# Altium schematic sheet Sheet1.SchDoc
size A3; CheckedBy: PHAN TRONG TIEN; CompanyName: HANOI UNIVERSITY OF INDUSTRY; DrawnBy: PHAN TRONG TIEN; Engineer: P.TRONG TIEN; Rule: PcbType=ProtelPcb
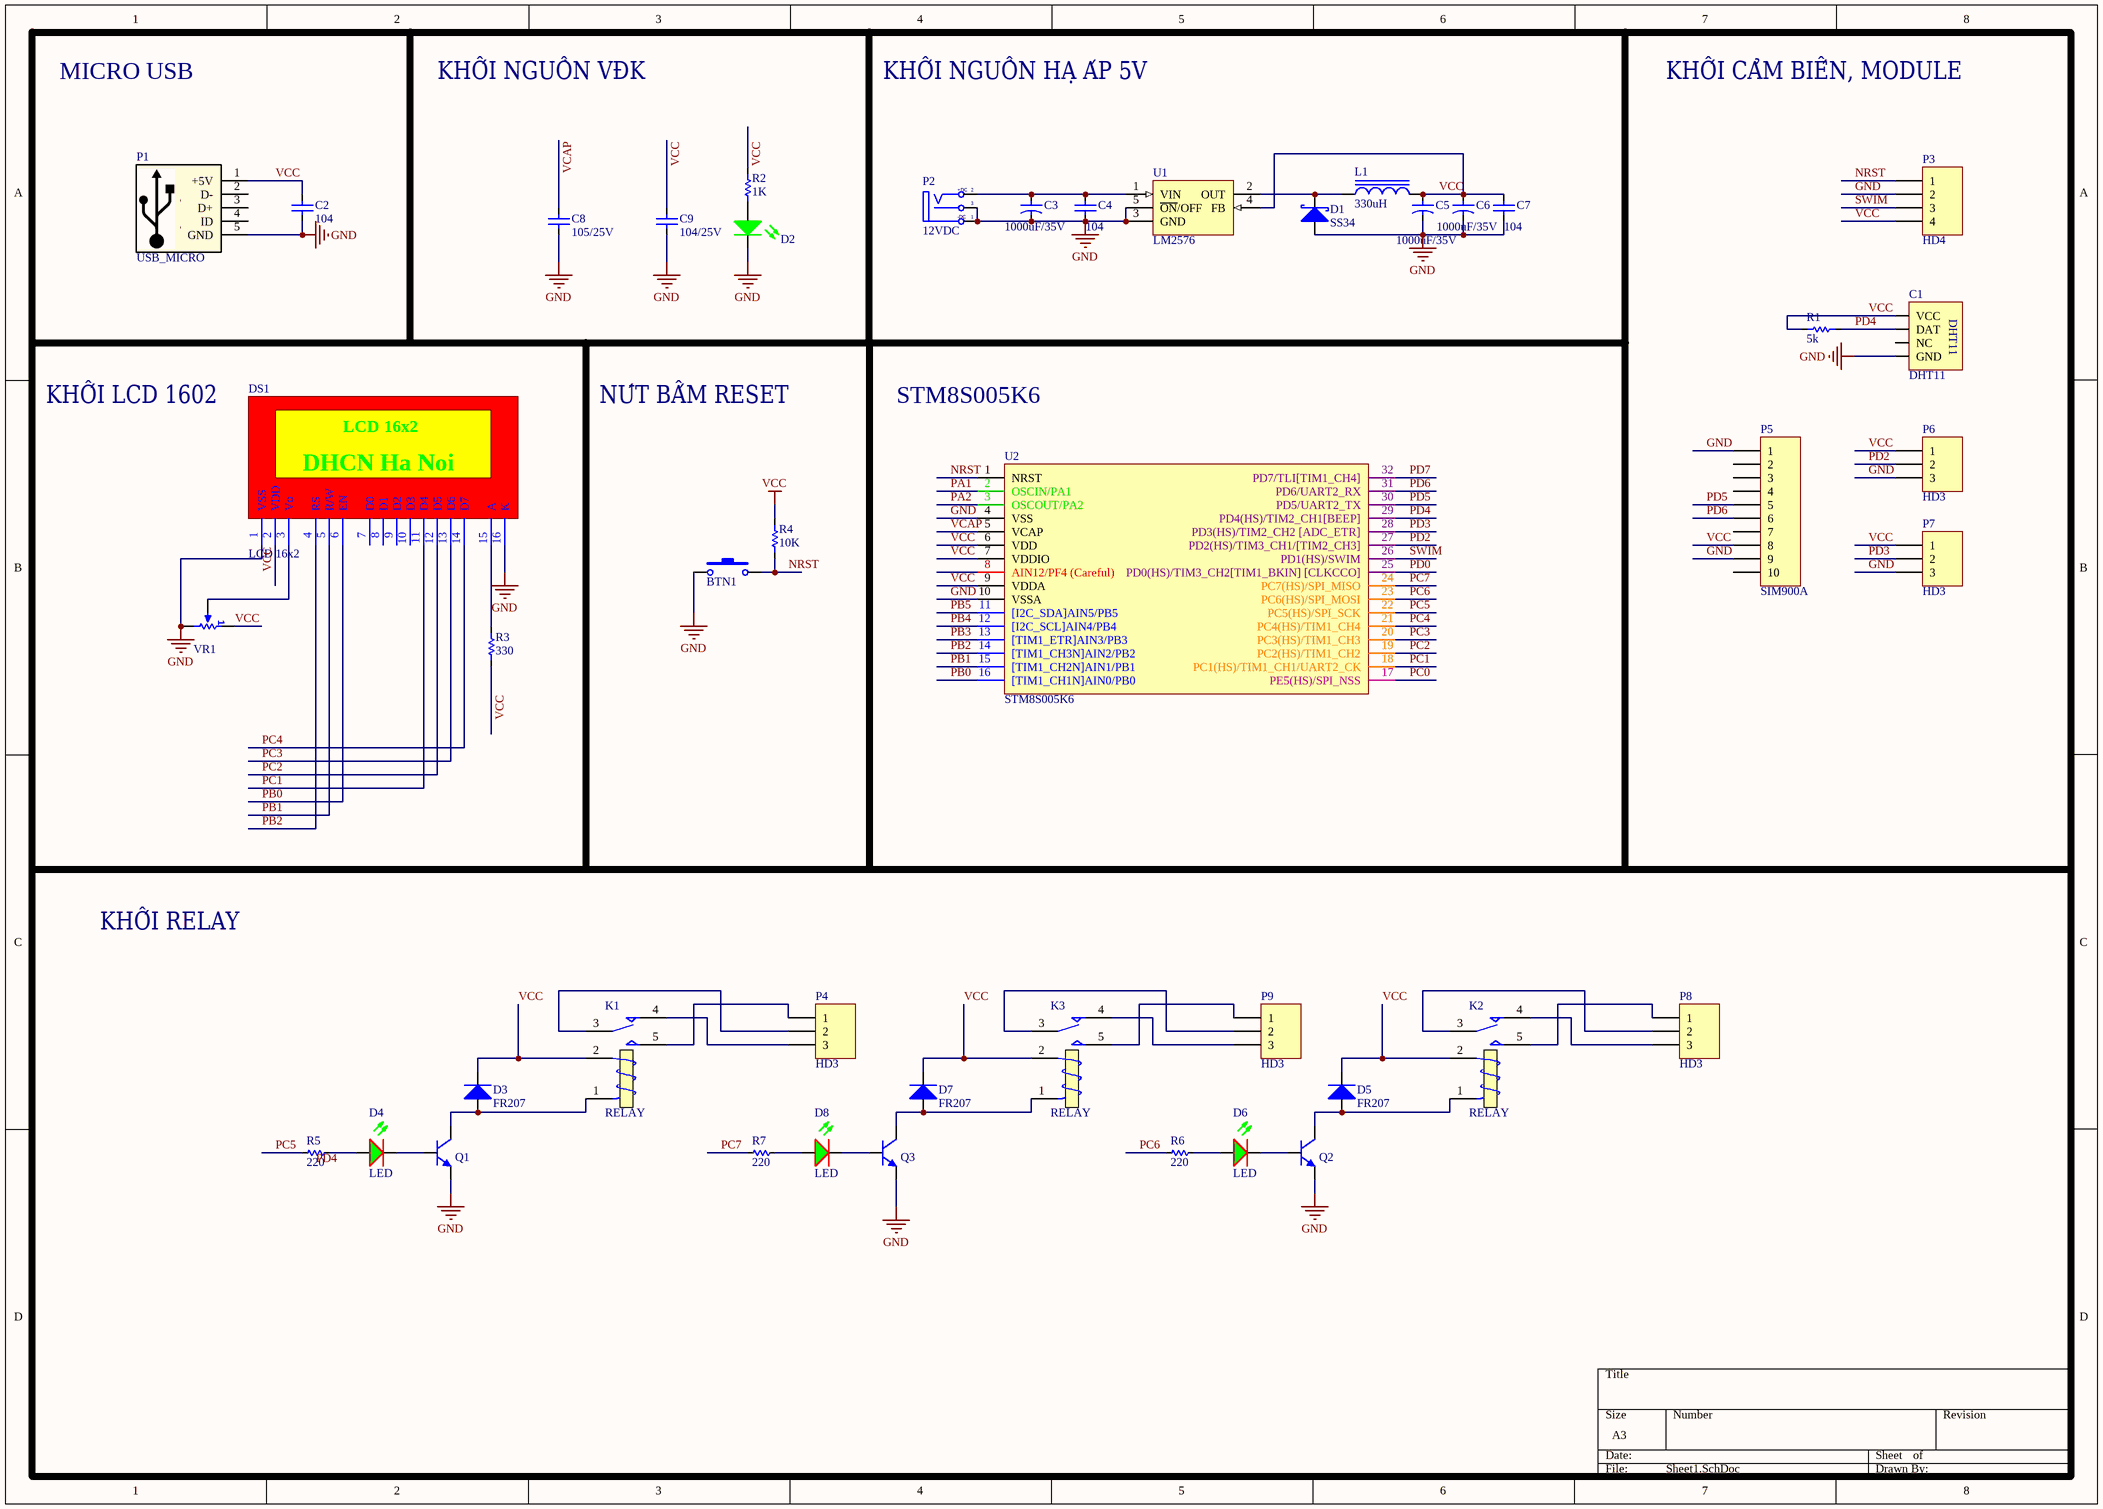
[diagram p0: Sheet1.SchDoc]

## Parts
BTN1  BT  [BUTTON SMD MINI]  (value not drawn)
C1  DHT11  [DHT11]
C2  104  [CAP-0805]
C3  1000uF/35V  [CAP 13x25x5]
C4  104  [CAP-0603]
C5  1000uF/35V  [CAP 13x25x5]
C6  1000uF/35V  [CAP 13x25x5]
C7  104  [CAP-0603]
C8  105/25V  [CAP-0805]
C9  104/25V  [CAP-0805]
D1  SS34  [DO-214AC]
D2  LED-G  [LED-0603-G]  (value not drawn)
D3  FR207  [DO-41-300MIL-1N4007]
D4  LED  [LED_5mm]
D5  FR207  [DO-41-300MIL-1N4007]
D6  LED  [LED_5mm]
D7  FR207  [DO-41-300MIL-1N4007]
D8  LED  [LED_5mm]
DS1  LCD 16x2  [LCD16x2_V1]
K1  RELAY  [RELAY 12V_112D1]
K2  RELAY  [RELAY 12V_112D1]
K3  RELAY  [RELAY 12V_112D1]
L1  330uH  [INDUCTOR 2]
P1  USB_MICRO  [USB_MICRO]
P2  value 12VDC  [JACK DC 5.5x2]  (hidden comment: JACK DC)
P3  HD4  [XH2.54-4A]
P4  HD3  [CON 3]
P5  SIM900A  [HD 10]
P6  HD3  [JUMP 3]
P7  HD3  [JUMP 3]
P8  HD3  [CON 3]
P9  HD3  [CON 3]
Q1  C1815  [TO 92]  (value not drawn)
Q2  C1815  [TO 92]  (value not drawn)
Q3  C1815  [TO 92]  (value not drawn)
R1  5k  [R-0805]
R2  1K  [R-0805-1K]
R3  330  [R-0805-1K]
R4  10K  [R-0805-1K]
R5  220  [RES-1/4W]
R6  220  [RES-1/4W]
R7  220  [RES-1/4W]
U1  LM2576  [TO 263 [LM2576]]
U2  STM8S005K6  [LQFP-32-STM8S005K6]
VR1  VR  [POT-3296W]  (value not drawn)

## Nets
GND: BTN1.1 C1.4(GND) C2.2 C3.2 C4.2 C5.2 C6.2 C7.2 C8.2 C9.2 D1.1(A) D2.2(K) DS1.1(VSS) DS1.16(K) P1.5(GND) P2.1(T) P2.3(S) P3.2 P5.1 P5.9 P6.3 P7.3 Q1.1(E) Q2.1(E) Q3.1(E) U1.3(GND) U1.5(~{ON}/OFF) U2.4(VSS) U2.10(VSSA) VR1.3(BOT)
VCC: C1.1(VCC) C2.1 C5.1 C6.1 C7.1 C9.1 D3.2(K) D5.2(K) D7.2(K) DS1.2(VDD) K1.2(T1) K2.2(T1) K3.2(T1) L1.2 P1.1(+5V) P3.4 P5.8 P6.1 P7.1 R1.1 R2.2 R3.1 R4.2 U1.4(FB) U2.6(VDD) U2.7(VDDIO) U2.9(VDDA) VR1.1(TOP)
NRST: BTN1.2 P3.1 R4.1 U2.1(NRST)
PA1: U2.2(OSCIN/PA1)
PA2: U2.3(OSCOUT/PA2)
PB0: DS1.6(EN) U2.16([TIM1_CH1N]AIN0/PB0)
PB1: DS1.5(R/W) U2.15([TIM1_CH2N]AIN1/PB1)
PB2: DS1.4(RS) U2.14([TIM1_CH3N]AIN2/PB2)
PB3: U2.13([TIM1_ETR]AIN3/PB3)
PB4: U2.12([I2C_SCL]AIN4/PB4)
PB5: U2.11([I2C_SDA]AIN5/PB5)
PC0: U2.17(PE5(HS)/SPI_NSS)
PC1: DS1.11(D4) U2.18(PC1(HS)/TIM1_CH1/UART2_CK)
PC2: DS1.12(D5) U2.19(PC2(HS)/TIM1_CH2)
PC3: DS1.13(D6) U2.20(PC3(HS)/TIM1_CH3)
PC4: DS1.14(D7) U2.21(PC4(HS)/TIM1_CH4)
PC5: R5.1 U2.22(PC5(HS)/SPI_SCK)
PC6: R6.1 U2.23(PC6(HS)/SPI_MOSI)
PC7: R7.1 U2.24(PC7(HS)/SPI_MISO)
PD0: U2.25(PD0(HS)/TIM3_CH2[TIM1_BKIN]_[CLKCCO])
PD2: P6.2 U2.27(PD2(HS)/TIM3_CH1/[TIM2_CH3])
PD3: P7.2 U2.28(PD3(HS)/TIM2_CH2_[ADC_ETR])
PD4: C1.2(DAT) R1.2 U2.29(PD4(HS)/TIM2_CH1[BEEP])
PD5: P5.5 U2.30(PD5/UART2_TX)
PD6: P5.6 U2.31(PD6/UART2_RX)
PD7: U2.32(PD7/TLI[TIM1_CH4])
SWIM: P3.3 U2.26(PD1(HS)/SWIM)
VCAP: C8.1 U2.5(VCAP)
NetC3_1: C3.1 C4.1 P2.2(TN) U1.1(VIN)
NetD1_2: D1.2(K) L1.1 U1.2(OUT)
NetD2_1: D2.1(A) R2.1
NetD3_1: D3.1(A) K1.1(T2) Q1.2(C)
NetD4_1: D4.1(A) R5.2
NetD4_2: D4.2(K) Q1.3(B)
NetD5_1: D5.1(A) K2.1(T2) Q2.2(C)
NetD6_1: D6.1(A) R6.2
NetD6_2: D6.2(K) Q2.3(B)
NetD7_1: D7.1(A) K3.1(T2) Q3.2(C)
NetD8_1: D8.1(A) R7.2
NetD8_2: D8.2(K) Q3.3(B)
NetDS1_3: DS1.3(Vo) VR1.2(TAP)
NetDS1_15: DS1.15(A) R3.2
NetK1_3: K1.3(COM) P4.2
NetK1_4: K1.4(NC) P4.3
NetK1_5: K1.5(NO) P4.1
NetK2_3: K2.3(COM) P8.2
NetK2_4: K2.4(NC) P8.3
NetK2_5: K2.5(NO) P8.1
NetK3_3: K3.3(COM) P9.2
NetK3_4: K3.4(NC) P9.3
NetK3_5: K3.5(NO) P9.1

Not connected (* = marked no-connect by the designer): C1 3(NC); DS1 7(D0) 8(D1) 9(D2) 10(D3); P1 2(D-) 3(D+) 4(ID); P5 2 3 4 7 10; U2 8(AIN12/PF4_(Careful))

## Notes on the sheet
- MICRO USB
- KHỐI NGUỒN VĐK
- KHỐI NGUỒN HẠ ÁP 5V
- KHỐI CẢM BIẾN, MODULE
- KHỐI LCD 1602
- NÚT BẤM RESET
- STM8S005K6
- KHỐI RELAY
- Labels drawn without touching a wire or pin: PD4
- (in symbol JACK DC) +DC; -DC
- (in symbol LCD TypeA) DHCN Ha Noi

## Library data of the parts
BTN1 = BUTTON
C1 = DHT11: Manufacturer: W¨¹rth Elektronik eiSos GmbH; partNo: 613004143121; ComponentLink1 Description: Manufacturer; ComponentLink2 Description: Datasheet; NoPins: 04; Created Date: 29 March 2013; ComponentLink1URL: http://www.we-online.com; ComponentLink2URL: http://katalog.we-online.de/em/datasheet/6130xx143121.pdf; Created by: Karrer Zheng
C2 = CAP-CER-22pF-50V-0805-10%: 22pF ±5% 50V Ceramic Capacitor C0G, NP0 0805 (2012 Metric); Manufacturer: Samsung Electro-Mechanics America, Inc.; Manufacturer Part Number: CL21B105KOFNNNE; Capacitance: 1µF; Tolerance: ±10%; Voltage - Rated: 16V; Temperature Coefficient: X7R; RoHS: RoHS Compliant; Category: Capacitors; Packaging: Cut Tape (CT); Part Status: Active; Operating Temperature: -55°C ~ 125°C; Features: -; Ratings: -; Applications: General Purpose; Failure Rate: *; Mounting Type: Surface Mount, MLCC; Package / Case: 0805 (2012 Metric); Size / Dimension: 0.079" L x 0.049" W (2.00mm x 1.25mm); Height - Seated (Max): -; Thickness (Max): 0.053" (1.35mm); Lead Spacing: -; Lead Style: -; ComponentLink1URL: http://www.samsungsem.com/kr/front/downloadcms.do?path=/kr/support/product-search/mlcc/__icsFiles/afieldfile/2014/11/05&fileName=C_CL21B105KOFNNNE.pdf; ComponentLink1Description: http://www.samsungsem.com/kr/front/downloadcms.do?path=/kr/support/product-search/mlcc/__icsFiles/afieldfile/2014/11/05&fileName=C_CL21B105KOFNNNE.pdf; Supplier 1: Digi-Key; Stock 1: 35138; Pricing 1: 1=0.1, 10=0.044, 25=0.032, 50=0.024, 100=0.0196, 250=0.0164, 500=0.014, 1000=0.011 (USD); ComponentLink2URL: http://www.samsungsem.com/kr/front/downloadcms.do?path=/kr/support/product-search/mlcc/__icsFiles/afieldfile/2014/11/05&fileName=C_CL21C220JBANNNC.pdf; ComponentLink2Description: http://www.samsungsem.com/kr/front/downloadcms.do?path=/kr/support/product-search/mlcc/__icsFiles/afieldfile/2014/11/05&fileName=C_CL21C220JBANNNC.pdf; Supplier Part Number 1: 1276-1047-1-ND
C3 C5 C6 = CAP 1000uF/35V
C4 C7 = CAP-CER-102-50V-0603-10%_6: 1000pF 50V Ceramic Capacitor X7R 0603 (1608 Metric) 0.063" L x 0.031" W (1.60mm x 0.80mm); Manufacturer: Samsung Electro-Mechanics America, Inc.; Manufacturer Part Number: CL10B102KB8NNNC; Tolerance: ±10%; Supplier 1: Digi-Key; RoHS: RoHS Compliant; Category: Capacitors; Stock 1: 208000; Pricing 1: 4000=0.00322, 8000=0.00294, 12000=0.0028, 28000=0.00266, 100000=0.00193 (USD); Packaging: Tape & Reel (TR); Part Status: Active; Capacitance: 1000pF; Voltage - Rated: 50V; Temperature Coefficient: X7R; Operating Temperature: -55°C ~ 125°C; Features: -; Ratings: -; Applications: General Purpose; Failure Rate: *; Mounting Type: Surface Mount, MLCC; Package / Case: 0603 (1608 Metric); Size / Dimension: 0.063" L x 0.031" W (1.60mm x 0.80mm); Height - Seated (Max): -; Thickness (Max): 0.035" (0.90mm); Lead Spacing: -; Lead Style: -; ComponentLink1URL: http://www.samsungsem.com/kr/support/product-search/mlcc/__icsFiles/afieldfile/2016/08/18/S_CL10B102KB8NNNC.pdf; ComponentLink1Description: http://www.samsungsem.com/kr/support/product-search/mlcc/__icsFiles/afieldfile/2016/08/18/S_CL10B102KB8NNNC.pdf; Supplier Part Number 1: 1276-1018-2-ND
C8 C9 = CAP-CER-104-25V-0805-10%: 0.10µF ±10% 25V Ceramic Capacitor X7R 0805 (2012 Metric); Manufacturer: Samsung Electro-Mechanics America, Inc.; Manufacturer Part Number: CL21B104KACNNNC; Supplier 1: Digi-Key; RoHS: RoHS Compliant; Category: Capacitors; Stock 1: 288005; Pricing 1: 1=0.1, 10=0.033, 25=0.024, 50=0.018, 100=0.0147, 250=0.01232, 500=0.0105, 1000=0.00825 (USD); Packaging: Cut Tape (CT); Part Status: Active; Capacitance: 0.10µF; Tolerance: ±10%; Voltage - Rated: 25V; Temperature Coefficient: X7R; Operating Temperature: -55°C ~ 125°C; Features: -; Ratings: -; Applications: General Purpose; Failure Rate: *; Mounting Type: Surface Mount, MLCC; Package / Case: 0805 (2012 Metric); Size / Dimension: 0.079" L x 0.049" W (2.00mm x 1.25mm); Height - Seated (Max): -; Thickness (Max): 0.037" (0.95mm); Lead Spacing: -; Lead Style: -; ComponentLink1URL: http://www.samsungsem.com/kr/support/product-search/mlcc/__icsFiles/afieldfile/2016/08/18/S_CL21B104KACNNNC.pdf; ComponentLink1Description: http://www.samsungsem.com/kr/support/product-search/mlcc/__icsFiles/afieldfile/2016/08/18/S_CL21B104KACNNNC.pdf; Supplier Part Number 1: 1276-1099-1-ND
D1 = SS14: Diode Schottky 40V 1A Surface Mount SMA (DO-214AC); Manufacturer: Fairchild Semiconductor; Voltage - Forward (Vf) (Max) @ If: 500mV @ 1A; Speed: Fast Recovery =< 500ns, > 200mA (Io); Current - Reverse Leakage @ Vr: 200µA @ 40V; Supplier 1: Digi-Key; Manufacturer Part Number: SS14; RoHS: RoHS Compliant; Category: Discrete Semiconductor Products; Stock 1: 120000; Pricing 1: 7500=0.08041, 15000=0.07332, 37500=0.06859, 52500=0.06149, 187500=0.05913 (USD); Packaging: Tape & Reel (TR); Part Status: Active; Diode Type: Schottky; Voltage - DC Reverse (Vr) (Max): 40V; Current - Average Rectified (Io): 1A; Reverse Recovery Time (trr): -; Capacitance @ Vr, F: -; Mounting Type: Surface Mount; Package / Case: DO-214AC, SMA; Supplier Device Package: SMA (DO-214AC); Operating Temperature - Junction: -65°C ~ 125°C; ComponentLink1URL: https://www.fairchildsemi.com/datasheets/SS/SS12.pdf; ComponentLink1Description: https://www.fairchildsemi.com/datasheets/SS/SS12.pdf; Supplier Part Number 1: SS14TR-ND; Supplier 2: Digi-Key; Stock 2: 297273; Pricing 2: 1=0.44, 10=0.33, 100=0.1867, 500=0.12364, 1000=0.09478 (USD); ComponentLink2URL: http://www.diodes.com/_files/datasheets/ds30217.pdf; ComponentLink2Description: http://www.diodes.com/_files/datasheets/ds30217.pdf; Supplier Part Number 2: 1N5819HW-FDICT-ND
D2 = LED-0603-G: Green 570nm LED Indication - Discrete 2.1V 0603 (1608 Metric); Manufacturer: Everlight Electronics Co Ltd; Manufacturer Part Number: QTLP601C4TR; Lens Color: Colorless; Lens Transparency: Clear; Millicandela Rating: 15mcd; Lens Style/Size: Rectangle with Flat Top, 1.20mm x 0.80mm; Current - Test: 20mA; Viewing Angle: 120°; Wavelength - Peak: 565nm; Supplier 1: Digi-Key; RoHS: RoHS Compliant; Category: Optoelectronics; Stock 1: 3227; Pricing 1: 1=0.51, 10=0.366, 25=0.2808, 100=0.1832, 250=0.13432, 500=0.11396, 1000=0.09361 (USD); Packaging: Cut Tape (CT); Part Status: Active; Color: Green; Voltage - Forward (Vf) (Typ): 2.1V; Mounting Type: Surface Mount; Wavelength - Dominant: 570nm; Features: -; Package / Case: 0603 (1608 Metric); Supplier Device Package: *; Size / Dimension: 1.60mm L x 0.80mm W; Height (Max): 0.60mm; ComponentLink1URL: http://media.digikey.com/pdf/Data%20Sheets/Everlight%20PDFs/QTLP601C-2,3,4,7,B.pdf; ComponentLink1Description: http://media.digikey.com/pdf/Data%20Sheets/Everlight%20PDFs/QTLP601C-2,3,4,7,B.pdf; Supplier Part Number 1: 1080-1405-1-ND
D3 D5 D7 = 1N4007: Diode Standard 1000V (1kV) 1A Surface Mount SMB; Manufacturer: Diodes Incorporated; Manufacturer Part Number: RS1MB-13; Voltage - Forward (Vf) (Max) @ If: 1.3V @ 1A; Speed: Fast Recovery =< 500ns, > 200mA (Io); Reverse Recovery Time (trr): 500ns; Current - Reverse Leakage @ Vr: 5µA @ 1000V; Capacitance @ Vr, F: 15pF @ 4V, 1MHz; Supplier 1: Digi-Key; RoHS: RoHS non-compliant; Category: Discrete Semiconductor Products; Stock 1: 0; Pricing 1: 30000=0 (USD); Packaging: Tape & Reel (TR); Part Status: Discontinued; Diode Type: Standard; Voltage - DC Reverse (Vr) (Max): 1000V (1kV); Current - Average Rectified (Io): 1A; Mounting Type: Surface Mount; Package / Case: DO-214AA, SMB; Supplier Device Package: SMB; Operating Temperature - Junction: -65°C ~ 150°C; ComponentLink1URL: http://media.digikey.com/pdf/Data%20Sheets/Diodes%20PDFs/RS1.pdf; ComponentLink1Description: http://media.digikey.com/pdf/Data%20Sheets/Diodes%20PDFs/RS1.pdf; Supplier Part Number 1: RS1MBDITR-ND
DS1 = LCD TypeA
K1-K3 = RELAY D
L1 = INDUCTOR
P2 = JACK DC: Jac DC input
P3 = HEADER 4
P4 P6-P9 = HEADER 3
P5 = HEADER 10
Q1-Q3 = C1815-TO92
R1 = R-0805: No Solder Or Re-Calculated
R2-R4 = R-0805/5%-1K: RES SMD 1K OHM 5% 1/8W 0805; Manufacturer: Yageo; Manufacturer Part Number: RC0805JR-071KL; Power (Watts): 0.125W, 1/8W; Temperature Coefficient: ±100ppm/°C; Supplier 1: Digi-Key; RoHS: RoHS Compliant; Category: Resistors; Stock 1: 1774840; Pricing 1: 1=0.1, 10=0.018, 25=0.0128, 100=0.0073, 250=0.00556, 500=0.00444, 1000=0.00326, 2500=0.00283 (USD); Packaging: Cut Tape (CT); Part Status: Active; Resistance (Ohms): 1k; Tolerance: ±5%; Composition: Thick Film; Features: Moisture Resistant; Operating Temperature: -55°C ~ 155°C; Package / Case: 0805 (2012 Metric); Supplier Device Package: 0805; Size / Dimension: 0.079" L x 0.049" W (2.00mm x 1.25mm); Height: 0.024" (0.60mm); Number of Terminations: 2; Failure Rate: -; ComponentLink1URL: http://www.yageo.com/documents/recent/PYu-RC_Group_51_RoHS_L_04.pdf; ComponentLink1Description: http://www.yageo.com/documents/recent/PYu-RC_Group_51_RoHS_L_04.pdf; Supplier Part Number 1: 311-1.0KARCT-ND
R5-R7 = Res: Manufacturer: Generic Components; Class: Passive; SubClass: R; Published: 08/06/2000; Publisher: Altium Hobart Technology Centre
U2 = STM8S005K6: STM8 STM8S Microcontroller IC 8-Bit 16MHz 32KB (32K x 8) FLASH 32-LQFP (7x7); Manufacturer: STMicroelectronics; Manufacturer Part Number: STM8S005K6T6C; Connectivity: I²C, IrDA, LIN, SPI, UART/USART; Peripherals: Brown-out Detect/Reset, POR, PWM, WDT; Number of I/O: 25; EEPROM Size: 128 x 8; RAM Size: 2K x 8; Voltage - Supply (Vcc/Vdd): 2.95 V ~ 5.5 V; Data Converters: A/D 7x10b; Oscillator Type: Internal; Supplier 1: Digi-Key; RoHS: RoHS Compliant; Category: Integrated Circuits (ICs); Stock 1: 0; Pricing 1: 1500=0.754 (USD); Packaging: Tray; Part Status: Active; Core Processor: STM8; Core Size: 8-Bit; Speed: 16MHz; Program Memory Size: 32KB (32K x 8); Program Memory Type: FLASH; Operating Temperature: -40°C ~ 85°C (TA); Package / Case: 32-LQFP; Supplier Device Package: 32-LQFP (7x7); ComponentLink1URL: http://www.st.com/content/ccc/resource/technical/document/datasheet/21/5a/57/8b/f4/49/4a/12/DM00037613.pdf/files/DM00037613.pdf/jcr:content/translations/en.DM00037613.pdf; ComponentLink1Description: http://www.st.com/content/ccc/resource/technical/document/datasheet/21/5a/57/8b/f4/49/4a/12/DM00037613.pdf/files/DM00037613.pdf/jcr:content/translations/en.DM00037613.pdf; Supplier Part Number 1: STM8S005K6T6C-ND